# Altium project antenna_board.PrjPCB
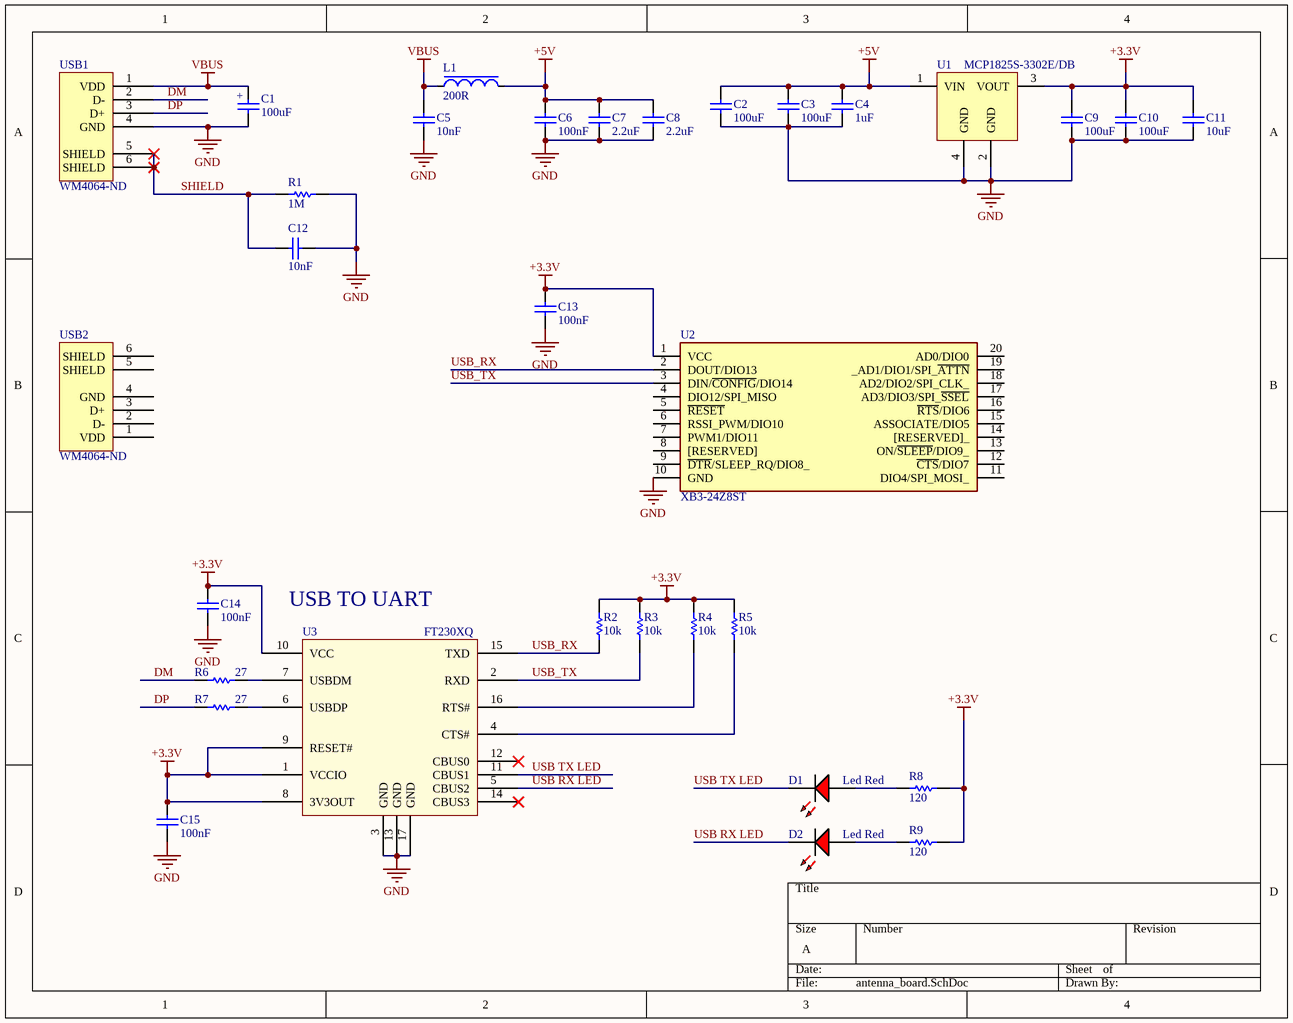
[diagram p0: antenna_board.SchDoc]
1 sheet, 32 parts. Net scope: global (net labels, ports and power ports of the same name join across sheets).
Board file: antenna_board.PcbDoc

## Sheet antenna_board.SchDoc
size A

### Parts
C1  100uF  [CapAlu6.3mmx12.5mm]
C2  100uF  [CAP_1206]
C3  100uF  [CAP_1206]
C4  1uF  [CAP_0402_M]
C5  10nF  [CAP_0402_M]
C6  100nF  [CAP_0402_M]
C7  2.2uF  [CAP_0402_M]
C8  2.2uF  [CAP_0402_M]
C9  100uF  [CAP_1206]
C10  100uF  [CAP_1206]
C11  10uF  [CAP_0603]
C12  10nF  [CAP_1206]
C13  100nF  [CAP_0402_M]
C14  100nF  [CAP_0402_M]
C15  100nF  [CAP_0402_M]
D1  Led Red  [TOPLED 0805]
D2  Led Red  [TOPLED 0805]
L1  200R  [IND_0603]
R1  1M  [RES_1206]
R2  10k  [RES_0402_M]
R3  10k  [RES_0402_M]
R4  10k  [RES_0402_M]
R5  10k  [RES_0402_M]
R6  27  [RES_0402_M]
R7  27  [RES_0402_M]
R8  120  [RES_0402_M]
R9  120  [RES_0402_M]
U1  MCP1825S-3302E/DB  [SOT230P700X180-4N]
U2  XB3-24Z8ST  [XB324Z8ST]
U3  FT230XQ  [QFN65P400X400X80_HS-17N]
USB1  Supplier Part Number 1: WM4064-ND  [USB2.5-2H4E]  (hidden comment: USB type-B jack)
USB2  Supplier Part Number 1: WM4064-ND  [USB2.5-2H4E]  (hidden comment: USB type-B jack)

### Nets
+3.3V: C9.1 C10.1 C11.1 C13.2 C14.2 C15.2 R2.2 R3.2 R4.2 R5.2 R8.2 R9.2 U1.3(VOUT) U2.1(VCC) U3.1(VCCIO) U3.8(3V3OUT) U3.9(RESET#) U3.10(VCC)
+5V: C2.1 C3.1 C4.2 C6.2 C7.2 C8.2 L1.2 U1.1(VIN)
GND: C1.2 C2.2 C3.2 C4.1 C5.1 C6.1 C7.1 C8.1 C9.2 C10.2 C11.2 C12.1 C13.1 C14.1 C15.1 R1.1 U1.2(GND) U1.4(GND) U2.10(GND) U3.3(GND) U3.13(GND) U3.17(GND) USB1.4(GND)
VBUS: C1.1 C5.2 L1.1 USB1.1(VDD)
DM: R6.1 USB1.2(D-)
DP: R7.1 USB1.3(D+)
SHIELD: C12.2 R1.2 USB1.5(SHIELD) USB1.6(SHIELD)
USB RX LED: D2.2(K) U3.5(CBUS2)
USB TX LED: D1.2(K) U3.11(CBUS1)
USB_RX: R2.1 U2.2(DOUT/DIO13) U3.15(TXD)
USB_TX: R3.1 U2.3(DIN/~{CONFIG}/DIO14) U3.2(RXD)
NetD1_1: D1.1(A) R8.1
NetD2_1: D2.1(A) R9.1
NetR4_1: R4.1 U3.16(RTS#)
NetR5_1: R5.1 U3.4(CTS#)
NetR6_2: R6.2 U3.7(USBDM)
NetR7_2: R7.2 U3.6(USBDP)

Not connected (* = marked no-connect by the designer): U2 4(DIO12/SPI_MISO) 5(~{RESET}) 6(RSSI_PWM/DIO10) 7(PWM1/DIO11) 8([RESERVED]) 9(~{DTR}/SLEEP_RQ/DIO8_) 11(DIO4/SPI_MOSI_) 12(~{CTS}/DIO7) 13(ON/~{SLEEP}/DIO9_) 14([RESERVED]_) 15(ASSOCIATE/DIO5) 16(~{RTS}/DIO6) 17(AD3/DIO3/SPI_~{SSEL}) 18(AD2/DIO2/SPI_CLK_) 19(_AD1/DIO1/SPI_~{ATTN}) 20(AD0/DIO0); U3 12(CBUS0)* 14(CBUS3)*; USB2 1(VDD) 2(D-) 3(D+) 4(GND) 5(SHIELD) 6(SHIELD)

### Notes on the sheet
- (near U3) USB TO UART
- (in symbol 100uF_35v_6.3x12.5) +

### Library data of the parts
C1 = 100uF_35v_6.3x12.5: Capacitor 35v 100uF 6.3mm; Manufacturer: Nichicon; Manufacturer Part Number: UHV1V101MED; Capacitance: 100µF; Tolerance: ±20%; Lifetime @ Temp.: 5000 Hrs @ 105°C; Polarization: Polar; Ripple Current: 220mA @ 120Hz; Impedance: 100 mOhm; Supplier 1: Digi-Key; RoHS: RoHS Compliant; Category: Capacitors; Stock 1: 5561; Pricing 1: 1=0.46, 10=0.32, 25=0.262, 50=0.224, 100=0.1919, 250=0.15992, 500=0.14394, 1000=0.12155, 2500=0.11515 (CAD); Packaging: Bulk; Voltage Rating: 35V; ESR (Equivalent Series Resistance): -; Operating Temperature: -40°C ~ 105°C; Applications: General Purpose; Lead Spacing: 0.098" (2.50mm); Size / Dimension: 0.248" Dia (6.30mm); Height - Seated (Max): 0.492" (12.50mm); Surface Mount Land Size: -; Mounting Type: Through Hole; Package / Case: Radial, Can; ComponentLink1URL: http://nichicon-us.com/english/products/pdfs/e-uhv.pdf; ComponentLink1Description: http://nichicon-us.com/english/products/pdfs/e-uhv.pdf; Supplier Part Number 1: 493-13394-ND
C2 C3 C9 C10 = 100uF_6.3v_1206_X5R: CAP CER 100UF 6.3V X5R 1206; Manufacturer: Murata Electronics North America; Manufacturer Part Number: GRM31CR60J107ME39L; Capacitance: 100µF; Tolerance: ±20%; Supplier 1: Digi-Key; RoHS: RoHS Compliant; Category: Capacitors; Stock 1: 450179; Pricing 1: 1=1.23, 10=1.048, 50=0.771, 100=0.6128, 250=0.51396, 500=0.46456, 1000=0.42502 (CAD); Packaging: Cut Tape (CT); Voltage - Rated: 6.3V; Temperature Coefficient: X5R; Mounting Type: Surface Mount, MLCC; Operating Temperature: -55°C ~ 85°C; Applications: General Purpose; Ratings: -; Package / Case: 1206 (3216 Metric); Size / Dimension: 0.126" L x 0.063" W (3.20mm x 1.60mm); Height - Seated (Max): -; Thickness (Max): 0.071" (1.80mm); Lead Spacing: -; Features: -; Lead Style: -; ComponentLink1URL: http://www.murata.com/~/media/webrenewal/support/library/catalog/products/capacitor/mlcc/c02e.pdf; ComponentLink1Description: http://www.murata.com/~/media/webrenewal/support/library/catalog/products/capacitor/mlcc/c02e.pdf; Supplier Part Number 1: 490-4539-1-ND
C4 = 1uF_25V_0402: CAP CER 1UF 25V 10% X5R 0402; Manufacturer: TDK Corporation; Manufacturer Part Number: C1005X5R1E105K050BC; Capacitance: 1µF; Supplier 1: Digi-Key; RoHS: RoHS Compliant; Category: Capacitors; Stock 1: 310467; Pricing 1: 1=0.27, 10=0.185, 100=0.0878, 250=0.074, 500=0.06196, 1000=0.05087, 5000=0.04301 (CAD); Packaging: Cut Tape (CT); Tolerance: ±10%; Voltage - Rated: 25V; Temperature Coefficient: X5R; Mounting Type: Surface Mount, MLCC; Operating Temperature: -55°C ~ 85°C; Applications: General Purpose; Ratings: -; Package / Case: 0402 (1005 Metric); Size / Dimension: 0.039" L x 0.020" W (1.00mm x 0.50mm); Height - Seated (Max): -; Thickness (Max): 0.022" (0.55mm); Lead Spacing: -; Features: -; Lead Style: -; ComponentLink1URL: http://product.tdk.com/en/catalog/datasheets/mlcc_commercial_general_en.pdf; ComponentLink1Description: http://product.tdk.com/en/catalog/datasheets/mlcc_commercial_general_en.pdf; Supplier Part Number 1: 445-9066-1-ND
C5 = 10nF_50V_0402: CAP CER 10000PF 50V 10% X7R 0402; Manufacturer: Kemet; Manufacturer Part Number: C0402C103K5RACTU; Supplier 1: Digi-Key; RoHS: RoHS Compliant; Category: Capacitors; Stock 1: 3556921; Pricing 1: 1=0.14, 10=0.037, 25=0.026, 50=0.0198, 100=0.0166, 250=0.01364, 1000=0.00893, 2500=0.00804, 5000=0.00744 (CAD); Packaging: Cut Tape (CT); Capacitance: 10000pF; Tolerance: ±10%; Voltage - Rated: 50V; Temperature Coefficient: X7R; Mounting Type: Surface Mount, MLCC; Operating Temperature: -55°C ~ 125°C; Applications: General Purpose; Ratings: -; Package / Case: 0402 (1005 Metric); Size / Dimension: 0.039" L x 0.020" W (1.00mm x 0.50mm); Height - Seated (Max): -; Thickness (Max): 0.022" (0.55mm); Lead Spacing: -; Features: -; Lead Style: -; ComponentLink1URL: http://www.kemet.com/docfinder?Partnumber=C0402C103K5RACTU; ComponentLink1Description: http://www.kemet.com/docfinder?Partnumber=C0402C103K5RACTU; Supplier Part Number 1: 399-3066-1-ND
C6 C13-C15 = 100nF_50V_0402: CAP CER 100NF 50V 20% X5R 0402; Manufacturer: TDK Corporation; Manufacturer Part Number: C1005X5R1H104M050BB; Capacitance: 0.1µF; Supplier 1: Digi-Key; RoHS: RoHS Compliant; Category: Capacitors; Stock 1: 218263; Pricing 1: 1=0.18, 10=0.122, 100=0.0579, 250=0.04872, 500=0.0408, 1000=0.03348, 5000=0.02831 (CAD); Packaging: Cut Tape (CT); Tolerance: ±20%; Voltage - Rated: 50V; Temperature Coefficient: X5R; Mounting Type: Surface Mount, MLCC; Operating Temperature: -55°C ~ 85°C; Applications: General Purpose; Ratings: -; Package / Case: 0402 (1005 Metric); Size / Dimension: 0.039" L x 0.020" W (1.00mm x 0.50mm); Height - Seated (Max): -; Thickness (Max): 0.022" (0.55mm); Lead Spacing: -; Features: -; Lead Style: -; ComponentLink1URL: http://product.tdk.com/en/catalog/datasheets/mlcc_commercial_general_en.pdf; ComponentLink1Description: http://product.tdk.com/en/catalog/datasheets/mlcc_commercial_general_en.pdf; Supplier Part Number 1: 445-5943-1-ND
C7 C8 = 2.2uF_10V_0402: CAP CER 2.2UF 10V 20% X5R 0402; Manufacturer: Taiyo Yuden; Manufacturer Part Number: LMK105BJ225MV-F; Capacitance: 2.2µF; Supplier 1: Digi-Key; RoHS: RoHS Compliant; Category: Capacitors; Stock 1: 258065; Pricing 1: 1=0.26, 10=0.173, 50=0.105, 100=0.0881, 250=0.07132, 500=0.0629, 1000=0.05348, 2500=0.04928, 5000=0.04509 (CAD); Packaging: Cut Tape (CT); Tolerance: ±20%; Voltage - Rated: 10V; Temperature Coefficient: X5R; Mounting Type: Surface Mount, MLCC; Operating Temperature: -55°C ~ 85°C; Applications: General Purpose; Ratings: -; Package / Case: 0402 (1005 Metric); Size / Dimension: 0.039" L x 0.020" W (1.00mm x 0.50mm); Height - Seated (Max): -; Thickness (Max): 0.022" (0.55mm); Lead Spacing: -; Features: -; Lead Style: -; ComponentLink1URL: http://www.yuden.co.jp/ut/product/category/capacitor/LMK105BJ225MV-F.pdf; ComponentLink1Description: http://www.yuden.co.jp/ut/product/category/capacitor/LMK105BJ225MV-F.pdf; Supplier Part Number 1: 587-3153-1-ND
C11 = 10uF_10V_0603: CAP CER 10UF 10V 20% X5R 0603; Manufacturer: Taiyo Yuden; Manufacturer Part Number: LMK107BBJ106MAHT; Capacitance: 10µF; Supplier 1: Digi-Key; Supplier Part Number 1: 587-3412-1-ND; RoHS: RoHS Compliant; Category: Capacitors; Stock 1: 90195; Pricing 1: 1=0.5, 10=0.437, 50=0.266, 100=0.2189, 250=0.17516, 500=0.15952, 1000=0.14107 (CAD); Packaging: Cut Tape (CT); Tolerance: ±20%; Voltage - Rated: 10V; Temperature Coefficient: X5R; Mounting Type: Surface Mount, MLCC; Operating Temperature: -55°C ~ 85°C; Applications: Automotive; Ratings: AEC-Q200; Package / Case: 0603 (1608 Metric); Size / Dimension: 0.063" L x 0.031" W (1.60mm x 0.80mm); Height - Seated (Max): -; Thickness (Max): 0.035" (0.90mm); Lead Spacing: -; Features: -; Lead Style: -; ComponentLink1URL: http://www.yuden.co.jp/productdata/catalog/en/mlcc01_hq_e.pdf; ComponentLink1Description: http://www.yuden.co.jp/productdata/catalog/en/mlcc01_hq_e.pdf
C12 = 10nF_500V_1206: CAP CER 10000PF 500V X7R 1206; Manufacturer: Samsung Electro-Mechanics America, Inc; Manufacturer Part Number: CL31B103KGFNNNE; Tolerance: ±10%; Supplier 1: Digi-Key; Supplier Part Number 1: 1276-3076-1-ND; RoHS: RoHS Compliant; Category: Capacitors; Stock 1: 9075; Pricing 1: 1=0.34, 10=0.28, 25=0.192, 100=0.1398, 500=0.09266, 1000=0.08216 (CAD); Packaging: Cut Tape (CT); Capacitance: 10000pF; Voltage - Rated: 500V; Temperature Coefficient: X7R; Mounting Type: Surface Mount, MLCC; Operating Temperature: -55°C ~ 125°C; Applications: General Purpose; Ratings: -; Package / Case: 1206 (3216 Metric); Size / Dimension: 0.126" L x 0.063" W (3.20mm x 1.60mm); Height - Seated (Max): -; Thickness (Max): 0.055" (1.40mm); Lead Spacing: -; Features: -; Lead Style: -; ComponentLink1URL: http://www.samsungsem.com/kr/front/downloadcms.do?path=/kr/support/product-search/mlcc/__icsFiles/afieldfile/2014/11/05&fileName=S_CL31B103KGFNNNE.pdf; ComponentLink1Description: http://www.samsungsem.com/kr/front/downloadcms.do?path=/kr/support/product-search/mlcc/__icsFiles/afieldfile/2014/11/05&fileName=S_CL31B103KGFNNNE.pdf
D1 D2 = TOPLED 0803: LED TOPLED 630NM SUP RED CLR SMD; Manufacturer: OSRAM Opto Semiconductors Inc; Manufacturer Part Number: LS M67K-H2L1-1-Z; Wavelength - Peak: 643nm; Millicandela Rating: 8.78mcd; Voltage - Forward (Vf) (Typ): 1.8V; Current - Test: 2mA; Viewing Angle: 120°; Lens Type: Clear; Lens Style/Size: Rectangle with Flat Top, 1.5mm x 1mm; Luminous Flux @ Current - Test: 25 mlm; Supplier 1: Digi-Key; Supplier Part Number 1: 475-2510-1-ND; RoHS: RoHS Compliant; Category: Optoelectronics; Stock 1: 23262; Pricing 1: 1=0.19, 10=0.162, 100=0.1295, 250=0.11328, 500=0.10354 (CAD); Packaging: Cut Tape (CT); Color: Red; Wavelength - Dominant: 630nm; Package / Case: 2-SMD, J-Lead; Size / Dimension: 2.20mm L x 1.40mm W; Height: 1.30mm; Mounting Type: Surface Mount; ComponentLink1URL: http://media.digikey.com/pdf/Data%20Sheets/Osram%20PDFs/LS,LO,LY_M67K.pdf; ComponentLink1Description: http://media.digikey.com/pdf/Data%20Sheets/Osram%20PDFs/LS,LO,LY_M67K.pdf
L1 = Ferrite_200 ohms_2A: FILTER CHIP 220 OHM 2A 0603; Manufacturer: Murata Electronics North America; Manufacturer Part Number: BLM18EG221SN1D; Impedance @ Frequency: 220 Ohm @ 100MHz; DC Resistance (DCR): 50 mOhm Max; Filter Type: Differential Mode - Single; Supplier 1: Digi-Key; RoHS: RoHS Compliant; Category: Filters; Stock 1: 382631; Pricing 1: 1=0.33, 10=0.254, 50=0.1814, 100=0.1632, 250=0.13784, 500=0.12332, 1000=0.10519 (CAD); Packaging: Cut Tape (CT); Current Rating: 2A; Package / Case: 0603 (1608 Metric); Mounting Type: Surface Mount; Height (Max): 0.037" (0.95mm); Size / Dimension: 0.063" L x 0.031" W (1.60mm x 0.80mm); ComponentLink1URL: http://search.murata.co.jp/Ceramy/image/img/PDF/ENG/L0110S0101BLM18E.pdf; ComponentLink1Description: http://search.murata.co.jp/Ceramy/image/img/PDF/ENG/L0110S0101BLM18E.pdf; Supplier Part Number 1: 490-3992-1-ND
R1 = 1M_5%_1206: RES SMD 1M OHM 5% 1/4W 1206; Manufacturer: Panasonic Electronic Components; Manufacturer Part Number: ERJ-8GEYJ105V; Power (Watts): 0.25W, 1/4W; Temperature Coefficient: ±200ppm/°C; Supplier 1: Digi-Key; Supplier Part Number 1: P1.0MECT-ND; RoHS: RoHS Compliant; Category: Resistors; Stock 1: 165352; Pricing 1: 1=0.14, 50=0.038, 100=0.029, 250=0.02152, 500=0.01588, 1000=0.01059, 2500=0.00894 (CAD); Packaging: Cut Tape (CT); Resistance (Ohms): 1M; Tolerance: ±5%; Composition: Thick Film; Features: Automotive AEC-Q200; Operating Temperature: -55°C ~ 155°C; Package / Case: 1206 (3216 Metric); Supplier Device Package: 1206; Size / Dimension: 0.126" L x 0.063" W (3.20mm x 1.60mm); Height: 0.028" (0.70mm); Number of Terminations: 2; ComponentLink1URL: http://industrial.panasonic.com/www-cgi/jvcr13pz.cgi?E+PZ+3+AOA0001+ERJ8GEYJ105V+7+WW; ComponentLink1Description: http://industrial.panasonic.com/www-cgi/jvcr13pz.cgi?E+PZ+3+AOA0001+ERJ8GEYJ105V+7+WW
R2-R5 = 10k_1%_0402: RES SMD 10K OHM 1% 1/10W 0402; Manufacturer: Panasonic Electronic Components; Manufacturer Part Number: ERJ-2RKF1002X; Power (Watts): 0.1W, 1/10W; Temperature Coefficient: ±100ppm/°C; Supplier 1: Digi-Key; RoHS: RoHS Compliant; Category: Resistors; Stock 1: 5818216; Pricing 1: 1=0.14, 50=0.0282, 100=0.0215, 250=0.01592, 500=0.01176, 1000=0.00784, 5000=0.00551 (CAD); Packaging: Cut Tape (CT); Resistance (Ohms): 10k; Tolerance: ±1%; Composition: Thick Film; Features: Automotive AEC-Q200; Operating Temperature: -55°C ~ 155°C; Package / Case: 0402 (1005 Metric); Supplier Device Package: 0402; Size / Dimension: 0.039" L x 0.020" W (1.00mm x 0.50mm); Height: 0.016" (0.40mm); Number of Terminations: 2; ComponentLink1URL: http://industrial.panasonic.com/www-cgi/jvcr13pz.cgi?E+PZ+3+AOA0002+ERJ2RKF1002X+7+WW; ComponentLink1Description: http://industrial.panasonic.com/www-cgi/jvcr13pz.cgi?E+PZ+3+AOA0002+ERJ2RKF1002X+7+WW; Supplier Part Number 1: P10.0KLCT-ND
R6 R7 = 27_1%_0402: RES SMD 27 OHM 1% 1/10W 0402; Manufacturer: Panasonic Electronic Components; Manufacturer Part Number: ERJ-2RKF27R0X; Power (Watts): 0.1W, 1/10W; Temperature Coefficient: ±100ppm/°C; Supplier 1: Digi-Key; Supplier Part Number 1: P27.0LCT-ND; RoHS: RoHS Compliant; Category: Resistors; Stock 1: 490131; Pricing 1: 1=0.16, 50=0.0234, 100=0.0171, 250=0.01308, 500=0.01048, 1000=0.00771, 5000=0.00553 (CAD); Packaging: Cut Tape (CT); Resistance (Ohms): 27; Tolerance: ±1%; Composition: Thick Film; Features: Automotive AEC-Q200; Operating Temperature: -55°C ~ 155°C; Package / Case: 0402 (1005 Metric); Supplier Device Package: 0402; Size / Dimension: 0.039" L x 0.020" W (1.00mm x 0.50mm); Height: 0.016" (0.40mm); Number of Terminations: 2; ComponentLink1URL: http://industrial.panasonic.com/www-cgi/jvcr13pz.cgi?E+PZ+3+AOA0002+ERJ2RKF27R0X+7+WW; ComponentLink1Description: http://industrial.panasonic.com/www-cgi/jvcr13pz.cgi?E+PZ+3+AOA0002+ERJ2RKF27R0X+7+WW
R8 R9 = 120_1%_0402: RES SMD 120 OHM 1% 1/10W 0402; Manufacturer: Panasonic Electronic Components; Manufacturer Part Number: ERJ-2RKF1200X; Power (Watts): 0.1W, 1/10W; Temperature Coefficient: ±100ppm/°C; Supplier 1: Digi-Key; RoHS: RoHS Compliant; Category: Resistors; Stock 1: 184236; Pricing 1: 1=0.14, 50=0.0282, 100=0.0215, 250=0.01592, 500=0.01176, 1000=0.00784, 5000=0.00551 (CAD); Packaging: Cut Tape (CT); Resistance (Ohms): 120; Tolerance: ±1%; Composition: Thick Film; Features: Automotive AEC-Q200; Operating Temperature: -55°C ~ 155°C; Package / Case: 0402 (1005 Metric); Supplier Device Package: 0402; Size / Dimension: 0.039" L x 0.020" W (1.00mm x 0.50mm); Height: 0.016" (0.40mm); Number of Terminations: 2; ComponentLink1URL: http://industrial.panasonic.com/www-cgi/jvcr13pz.cgi?E+PZ+3+AOA0002+ERJ2RKF1200X+7+WW; ComponentLink1Description: http://industrial.panasonic.com/www-cgi/jvcr13pz.cgi?E+PZ+3+AOA0002+ERJ2RKF1200X+7+WW; Supplier Part Number 1: P120LCT-ND
U1 = MCP1825S-3302E/DB: 500 mA, Low Voltage, Low Quiescent Current LDO Regulator; Manufacturer: Microchip Technology; Regulator Topology: Positive Fixed; Voltage - Output: 3.3V; Current - Output: 500mA; Voltage - Dropout (Typical): 0.21V @ 500mA; Number of Regulators: 1; Voltage - Input: Up to 6V; Supplier 1: Digi-Key; Supplier Part Number 1: MCP1825S-3302E/DB-ND; Manufacturer Part Number: MCP1825S-3302E/DB; RoHS: RoHS Compliant; Category: Integrated Circuits (ICs); Stock 1: 5172; Pricing 1: 1=0.61, 10=0.51, 25=0.43, 100=0.39 (USD); Packaging: Tube; Current - Limit (Min): -; Operating Temperature: -40°C ~ 125°C; Mounting Type: Surface Mount; Package / Case: TO-261-4, TO-261AA; Supplier Device Package: SOT-223-3; ComponentLink1URL: http://www.microchip.com/mymicrochip/filehandler.aspx?ddocname=en531698; ComponentLink1Description: http://www.microchip.com/mymicrochip/filehandler.aspx?ddocname=en531698
U2 = XB3-24Z8ST: Integrated Circuit; Manufacturer_Name: Digi International; Datasheet Link: https://componentsearchengine.com//XB3-24Z8ST.pdf; Height: 5mm; Mouser2 Part Number: 888-XB3-24Z8ST; Mouser2 Price/Stock: https://www.mouser.com/Search/Refine.aspx?Keyword=888-XB3-24Z8ST; Manufacturer_Part_Number: XB3-24Z8ST
U3 = FT230XQ-R: IC USB SERIAL BASIC UART 16QFN; Manufacturer: FTDI, Future Technology Devices International Ltd; Function: Bridge, USB to UART; Standards: USB 2.0; Voltage - Supply: 3.3 V ~ 5 V; Current - Supply: 8mA; Supplier 1: Digi-Key; Supplier Part Number 1: 768-1130-1-ND; Manufacturer Part Number: FT230XQ-R; RoHS: RoHS Compliant; Category: Integrated Circuits (ICs); Stock 1: 7567; Pricing 1: 1=2.64, 25=2.5508, 100=2.4601, 250=2.21412, 500=1.994, 1000=1.89042, 2500=1.86128 (CAD); Packaging: Cut Tape (CT); Protocol: USB; Interface: UART; Operating Temperature: -40°C ~ 85°C; Package / Case: 16-WQFN Exposed Pad; Supplier Device Package: 16-QFN (4x4); ComponentLink1URL: http://www.ftdichip.com/Support/Documents/DataSheets/ICs/DS_FT230X.pdf; ComponentLink1Description: http://www.ftdichip.com/Support/Documents/DataSheets/ICs/DS_FT230X.pdf
USB1 = MOLEX 0670688010: Supplier 1: Digi-Key
USB2 = USB Type-B: Supplier 1: Digi-Key